# Altium schematic sheet DSPPower.SchDoc: Decoupling
size A4; Date: 08.04.2017; Author: Jan Petrik; CompanyName: FreeDSP; DrawnBy: Jan Petrik; Organization: FreeDSP; DocumentNumber: 7; SheetNumber: 7; SheetTotal: 16; email: jan_petrik@centrum.cz; license: CC BY-NC 4.0
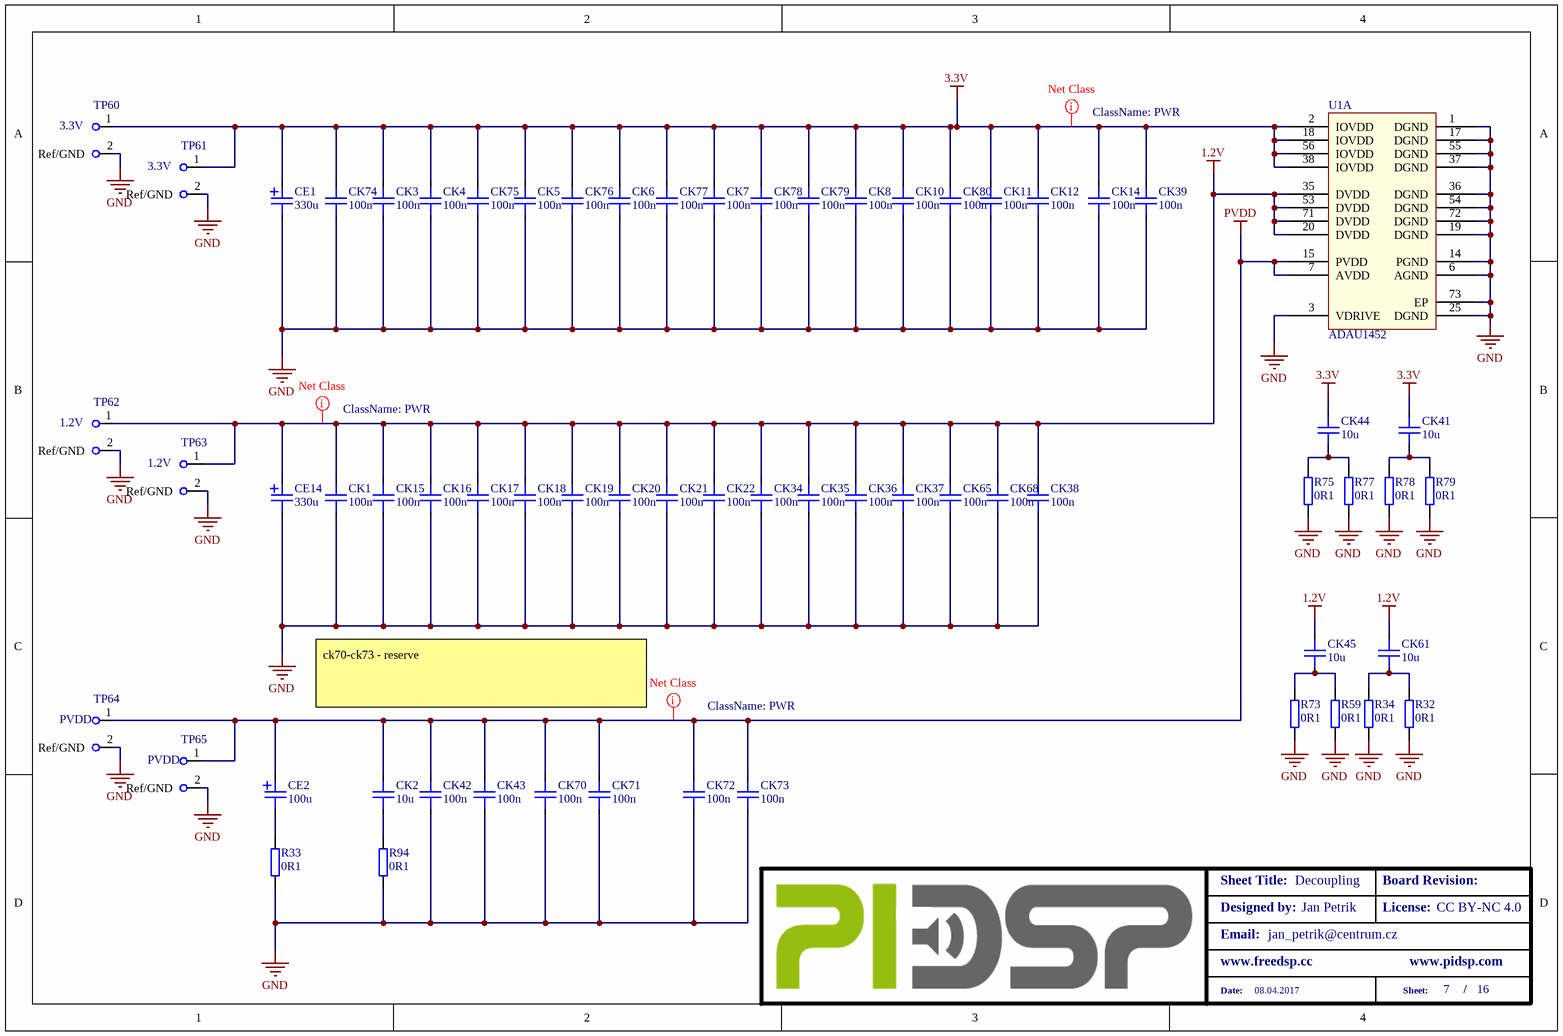
[diagram p0: DSPPower.SchDoc]

## Parts
CE1  330u  [CAPAE6.8X6.8(D_SIZE)]
CE2  100u  [CAPAE6.8X6.8(D_SIZE)]
CE14  330u  [CAPAE6.8X6.8(D_SIZE)]
CK1  100n  [CAPC1608X09N(SMC0603)]
CK2  10u  [CAPC3216X12N(SMC1206)]
CK3  100n  [CAPC1608X09N(SMC0603)_Fanout]
CK4  100n  [CAPC1608X09N(SMC0603)_Fanout]
CK5  100n  [CAPC1608X09N(SMC0603)_Fanout]
CK6  100n  [CAPC1608X09N(SMC0603)_Fanout]
CK7  100n  [CAPC1608X09N(SMC0603)_Fanout]
CK8  100n  [CAPC1608X09N(SMC0603)_Fanout]
CK10  100n  [CAPC1608X09N(SMC0603)_Fanout]
CK11  100n  [CAPC1608X09N(SMC0603)]
CK12  100n  [CAPC1608X09N(SMC0603)]
CK14  100n  [CAPC1608X09N(SMC0603)]
CK15  100n  [CAPC1608X09N(SMC0603)]
CK16  100n  [CAPC1608X09N(SMC0603)]
CK17  100n  [CAPC1608X09N(SMC0603)]
CK18  100n  [CAPC1608X09N(SMC0603)]
CK19  100n  [CAPC1608X09N(SMC0603)]
CK20  100n  [CAPC1608X09N(SMC0603)]
CK21  100n  [CAPC1608X09N(SMC0603)]
CK22  100n  [CAPC1608X09N(SMC0603)]
CK34  100n  [CAPC1608X09N(SMC0603)]
CK35  100n  [CAPC1608X09N(SMC0603)]
CK36  100n  [CAPC1608X09N(SMC0603)]
CK37  100n  [CAPC1608X09N(SMC0603)]
CK38  100n  [CAPC1608X09N(SMC0603)]
CK39  100n  [CAPC1608X09N(SMC0603)]
CK41  10u  [CAPC3216X12N(SMC1206)]
CK42  100n  [CAPC1608X09N(SMC0603)]
CK43  100n  [CAPC1608X09N(SMC0603)]
CK44  10u  [CAPC3216X12N(SMC1206)]
CK45  10u  [CAPC3216X12N(SMC1206)]
CK61  10u  [CAPC3216X12N(SMC1206)]
CK65  100n  [CAPC1608X09N(SMC0603)]
CK68  100n  [CAPC1608X09N(SMC0603)]
CK70  100n  [CAPC1608X09N(SMC0603)]
CK71  100n  [CAPC1608X09N(SMC0603)]
CK72  100n  [CAPC1608X09N(SMC0603)]
CK73  100n  [CAPC1608X09N(SMC0603)]
CK74  100n  [CAPC1608X09N(SMC0603)_Fanout]
CK75  100n  [CAPC1608X09N(SMC0603)_Fanout]
CK76  100n  [CAPC1608X09N(SMC0603)_Fanout]
CK77  100n  [CAPC1608X09N(SMC0603)_Fanout]
CK78  100n  [CAPC1608X09N(SMC0603)_Fanout]
CK79  100n  [CAPC1608X09N(SMC0603)_Fanout]
CK80  100n  [CAPC1608X09N(SMC0603)_Fanout]
R32  0R1  [RESC1608X06N(SMR0603)]
R33  0R1  [RESC1608X06N(SMR0603)]
R34  0R1  [RESC1608X06N(SMR0603)]
R59  0R1  [RESC1608X06N(SMR0603)]
R73  0R1  [RESC1608X06N(SMR0603)]
R75  0R1  [RESC1608X06N(SMR0603)]
R77  0R1  [RESC1608X06N(SMR0603)]
R78  0R1  [RESC1608X06N(SMR0603)]
R79  0R1  [RESC1608X06N(SMR0603)]
R94  0R1  [RESC1608X06N(SMR0603)]
TP60  3.3V  [HS/PDN_Testpoint]  (no BOM)
TP61  3.3V  [HS/PDN_Testpoint]  (no BOM)
TP62  1.2V  [HS/PDN_Testpoint]  (no BOM)
TP63  1.2V  [HS/PDN_Testpoint]  (no BOM)
TP64  PVDD  [HS/PDN_Testpoint]  (no BOM)
TP65  PVDD  [HS/PDN_Testpoint]  (no BOM)
U1  ADAU1452  [CP_72_6-handsoldering]  (part A of 6)

## Nets
1.2V: CE14.1 CK1.1 CK15.1 CK16.1 CK17.1 CK18.1 CK19.1 CK20.1 CK21.1 CK22.1 CK34.1 CK35.1 CK36.1 CK37.1 CK38.1 CK45.1 CK61.1 CK65.1 CK68.1 TP62.1 TP63.1 U1.20(DVDD) U1.35(DVDD) U1.53(DVDD) U1.71(DVDD)
3.3V: CE1.1 CK3.1 CK4.1 CK5.1 CK6.1 CK7.1 CK8.1 CK10.1 CK11.1 CK12.1 CK14.1 CK39.1 CK41.1 CK44.1 CK74.1 CK75.1 CK76.1 CK77.1 CK78.1 CK79.1 CK80.1 TP60.1 TP61.1 U1.2(IOVDD) U1.18(IOVDD) U1.38(IOVDD) U1.56(IOVDD)
GND: CE1.2 CE14.2 CK1.2 CK3.2 CK4.2 CK5.2 CK6.2 CK7.2 CK8.2 CK10.2 CK11.2 CK12.2 CK14.2 CK15.2 CK16.2 CK17.2 CK18.2 CK19.2 CK20.2 CK21.2 CK22.2 CK34.2 CK35.2 CK36.2 CK37.2 CK38.2 CK39.2 CK42.2 CK43.2 CK65.2 CK68.2 CK70.2 CK71.2 CK72.2 CK73.2 CK74.2 CK75.2 CK76.2 CK77.2 CK78.2 CK79.2 CK80.2 R32.2 R33.2 R34.2 R59.2 R73.2 R75.2 R77.2 R78.2 R79.2 R94.2 TP60.2(Ref/GND) TP61.2(Ref/GND) TP62.2(Ref/GND) TP63.2(Ref/GND) TP64.2(Ref/GND) TP65.2(Ref/GND) U1.1(DGND) U1.3(VDRIVE) U1.6(AGND) U1.14(PGND) U1.17(DGND) U1.19(DGND) U1.25(DGND) U1.36(DGND) U1.37(DGND) U1.54(DGND) U1.55(DGND) U1.72(DGND) U1.73(EP)
PVDD: CE2.1 CK2.1 CK42.1 CK43.1 CK70.1 CK71.1 CK72.1 CK73.1 TP64.1 TP65.1 U1.7(AVDD) U1.15(PVDD)
NetCE2_2: CE2.2 R33.1
NetCK2_2: CK2.2 R94.1
NetCK41_2: CK41.2 R78.1 R79.1
NetCK44_2: CK44.2 R75.1 R77.1
NetCK45_2: CK45.2 R59.1 R73.1
NetCK61_2: CK61.2 R32.1 R34.1

## Layout directives
net class PWR: 1.2V, 3.3V, PVDD

## Notes on the sheet
- ck70-ck73 - reserve
- Designed by:
- Sheet Title:
- Board Revision:
- License:
- Email:
- www.freedsp.cc
- www.pidsp.com
- Date:
- Sheet:
- /

## Library data of the parts
CE1 CE14 = 330u-6.3V-B6-OSCON: Polymer Aluminium Solid Capacitor 330uF, 6.3V; Signal Integrity: Cap; Tolerance: 20%/35V; Value: 330u; Package: D8H6.3; Simulation: Cap; Author: JP/27.03.2014; Voltage: 6.3V; Supplier 1: Mouser; Supplier Part Number 1: 710-875105144010
CE2 = 100u-16V-B6-OSCON: Polymer Aluminium Solid Capacitor 100uF, 16V; Mfg. Part Number: 875105344010; Signal Integrity: Cap; Tolerance: 20%/16V; Mfgr.: Wurth; Value: 100u; Package: D8H6.3; Simulation: Cap; Author: JP/27.03.2014; Voltage: 16V; Supplier 1: Mouser; Supplier Part Number 1: 710-875105344010
CK1 CK3 CK4 CK15 CK16 CK22 CK34-CK38 CK42 CK65 CK68 = 100n-50V-0603-X7R: MLCC; Signal Integrity: Cap; Tolerance: 10%; Voltage: 50V; Value: 100n; Package: SMC2523; Simulation: Cap; Author: JP/27.03.2014; Supplier 1: Mouser; Supplier Part Number 1: 81-GRM39X104K50D
CK2 CK41 CK44 CK45 CK61 = 10u-50V-1206-X5R: MLCC; Signal Integrity: Cap; Tolerance: 10%; Voltage: 50; Mfgr. PN: GRM31CR61H106MA2L; Mfgr.: Murata; Value: 10u; Package: SMC1206; Simulation: Cap; Author: JP/10.06.2014; Supplier 1: Mouser; Supplier Part Number 1: 81-GRM31CR61H106MA2L
CK5-CK8 CK10-CK12 CK14 CK17-CK21 CK39 CK43 CK70-CK80 = 100n-50V-0603-X7R: MLCC; Signal Integrity: Cap; Voltage: 50V; Tolerance: 10%; Value: 100n; Package: SMC2523; Simulation: Cap; Author: JP/27.03.2014; Supplier 1: Mouser; Supplier Part Number 1: 81-GRM39X104K50D
R32-R34 R59 R73 R75 R77-R79 R94 = 0R1-100mW-0603-ThickFilm: Chip Resistor; Tolerance & Rating: 1%/0.1W; Signal Integrity: Res; Packare: SMR0603; Value: 0R1; Simulation: Res; Author: JP/10.06.2014; SMD: 1; Supplier 1: Farnell; Supplier Part Number 1: 8867364; Type: Resistor
TP60-TP65 = TEST_POINT_HS/PDN: Testpoint - HS/PDN; SMD: 0
U1 = ADAU1452: SMD: 1; Supplier 1: Mouser; Supplier Part Number 1: 584-ADAU1452WBCPZ